# EAGLE design kompass (EAGLE 4.16)
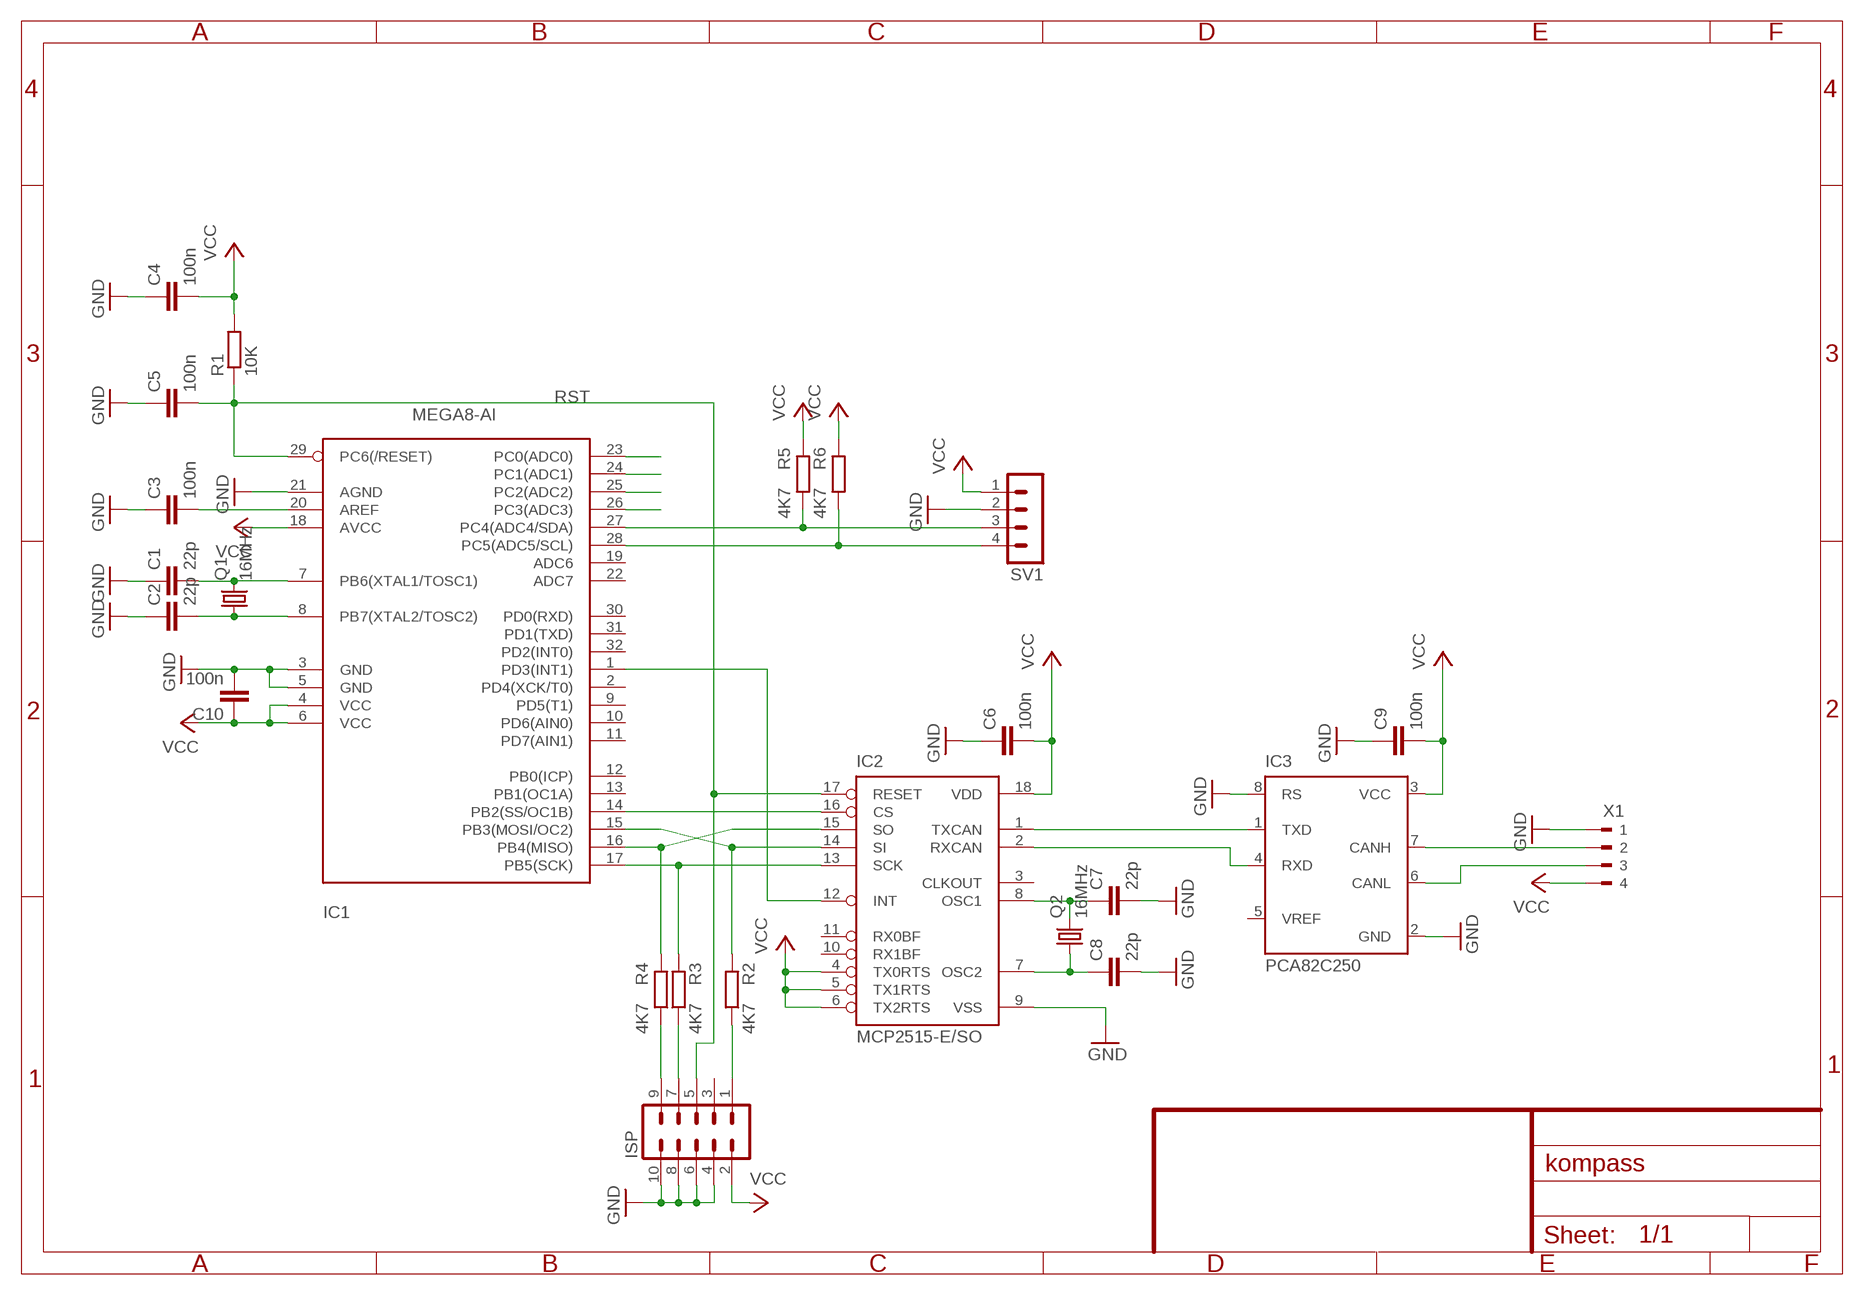
[diagram p0: schematic, sheet 1]

## Parts
C1  22p  C-EUC0603  [C0603]
C2  22p  C-EUC0603  [C0603]
C3  100n  C-EUC0603  [C0603]
C4  100n  C-EUC0603  [C0603]
C5  100n  C-EUC0603  [C0603]
C6  100n  C-EUC0603  [C0603]
C7  22p  C-EUC0603  [C0603]
C8  22p  C-EUC0603  [C0603]
C9  100n  C-EUC0603  [C0603]
C10  100n  C-EUC0603  [C0603]
IC1  MEGA8-AI  [TQFP32-08]
IC2  MCP2515-E/SO  [SO18L]
IC3  PCA82C250  [DIL08]
ISP  MA05-2  [MA05-2]
Q1  16MHz  CRYSTALHC49U-V  [HC49U-V]
Q2  16MHz  CRYSTALHC49U-V  [HC49U-V]
R1  10K  R-EU_R0805  [R0805]
R2  4K7  R-EU_R0805  [R0805]
R3  4K7  R-EU_R0805  [R0805]
R4  4K7  R-EU_R0805  [R0805]
R5  4K7  R-EU_R0805  [R0805]
R6  4K7  R-EU_R0805  [R0805]
SV1  MA04-1  [MA04-1]
X1  90-4  [90-4]

## Nets
GND: C1.1 C2.1 C3.1 C4.1 C5.1 C6.1 C7.2 C8.2 C9.1 C10.2 IC1.3(GND) IC1.5(GND) IC1.21(AGND) IC2.9(VSS) IC3.2(GND) IC3.8(RS) ISP.4 ISP.6 ISP.8 ISP.10 SV1.2 X1.1
N$1: IC3.7(CANH) X1.2
N$2: IC3.6(CANL) X1.3
N$3: C1.2 IC1.7(PB6(XTAL1/TOSC1)) Q1.2
N$4: C2.2 IC1.8(PB7(XTAL2/TOSC2)) Q1.1
N$5: C3.2 IC1.20(AREF)
N$6: IC1.14(PB2(SS/OC1B)) IC2.16(CS)
N$7: IC1.17(PB5(SCK)) IC2.13(SCK) R3.2
N$8: IC1.16(PB4(MISO)) IC2.15(SO) R4.2
N$9: IC1.15(PB3(MOSI/OC2)) IC2.14(SI) R2.2
N$10: IC1.1(PD3(INT1)) IC2.12(INT)
N$11: IC2.1(TXCAN) IC3.1(TXD)
N$12: IC2.2(RXCAN) IC3.4(RXD)
N$13: C7.1 IC2.8(OSC1) Q2.2
N$14: C8.1 IC2.7(OSC2) Q2.1
N$15: ISP.1 R2.1
N$16: ISP.7 R3.1
N$17: ISP.9 R4.1
N$18: IC1.28(PC5(ADC5/SCL)) R6.1 SV1.4
N$19: IC1.27(PC4(ADC4/SDA)) R5.1 SV1.3
N$20: IC1.26(PC3(ADC3))
N$21: IC1.25(PC2(ADC2))
N$22: IC1.24(PC1(ADC1))
N$23: IC1.23(PC0(ADC0))
RST: C5.2 IC1.29(PC6(/RESET)) IC2.17(RESET) ISP.5 R1.1
VCC: C4.2 C6.2 C9.2 C10.1 IC1.4(VCC) IC1.6(VCC) IC1.18(AVCC) IC2.4(TX0RTS) IC2.5(TX1RTS) IC2.6(TX2RTS) IC2.18(VDD) IC3.3(VCC) ISP.2 R1.2 R5.2 R6.2 SV1.1 X1.4
Unconnected: IC1.2(PD4(XCK/T0)) IC1.9(PD5(T1)) IC1.10(PD6(AIN0)) IC1.11(PD7(AIN1)) IC1.12(PB0(ICP)) IC1.13(PB1(OC1A)) IC1.19(ADC6) IC1.22(ADC7) IC1.30(PD0(RXD)) IC1.31(PD1(TXD)) IC1.32(PD2(INT0)) IC2.3(CLKOUT) IC2.10(RX1BF) IC2.11(RX0BF) IC3.5(VREF) ISP.3

## Library data of the parts
C1-C10 = rcl:C-EU: CAPACITOR, European symbol
IC1 = atmel:MEGA8: MICROCONTROLLER 8 Kbytes FLASH 1 kbytes SRAM 512 bytes EEPROM USART 6-channel 10 bit ADC 2-channel 8 bit ADC Source: avr.lbr
IC2 = mcp2515:MCP2515
IC3 = micro-philips:PCA82C250: CAN CONTROLLER INTERFACE
ISP = con-lstb:MA05-2: PIN HEADER
Q1 Q2 = crystal:CRYSTAL: CRYSTAL
R1-R6 = rcl:R-EU_: RESISTOR, European symbol
SV1 = con-lstb:MA04-1: PIN HEADER
X1 = con-weidmueller-sl35:90-4: WEIDMUELLER CLAMP CONNECTOR

## Board
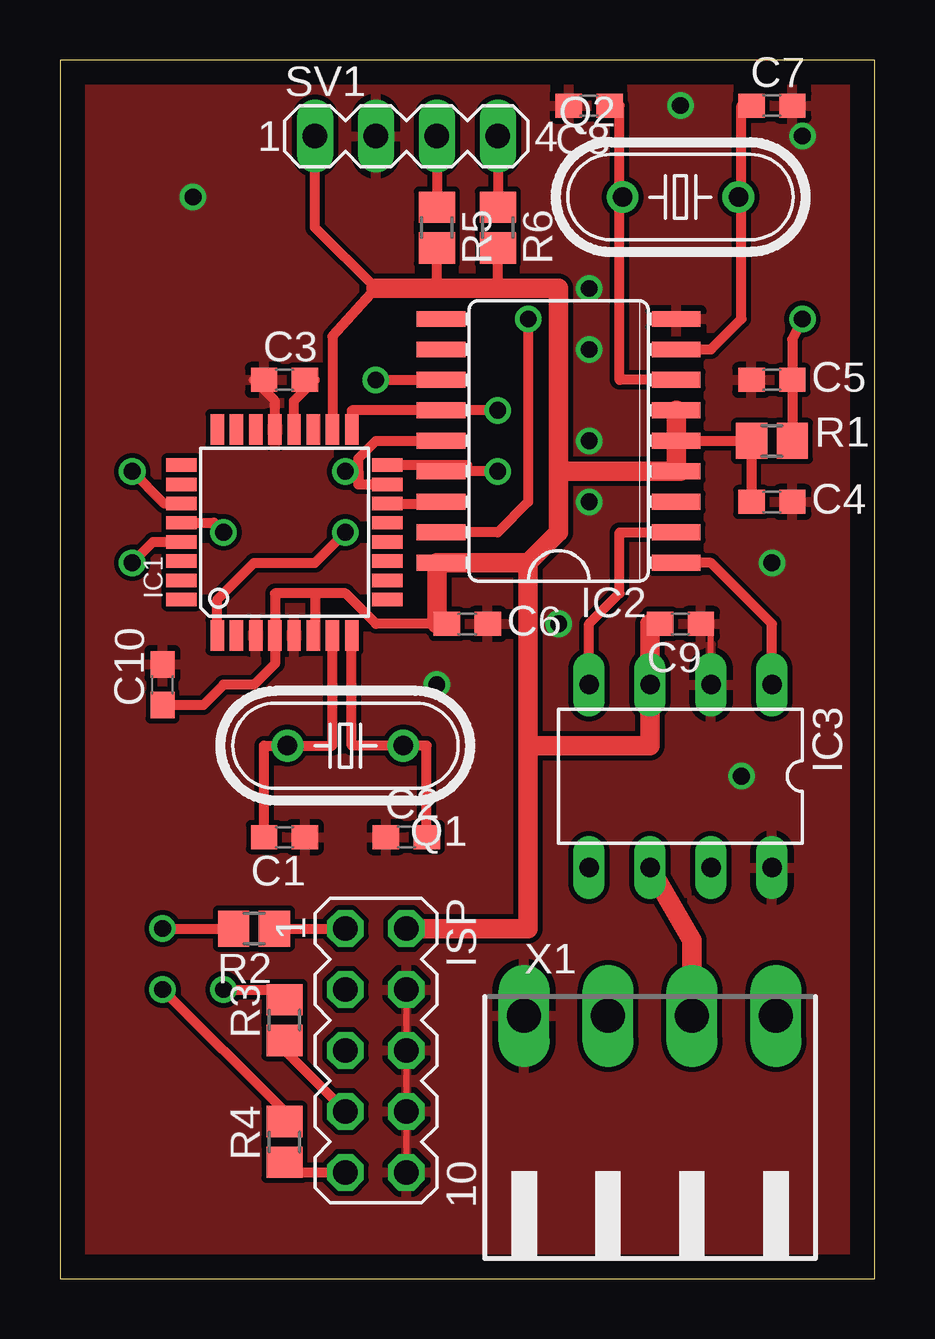
[diagram p1: board, top side]
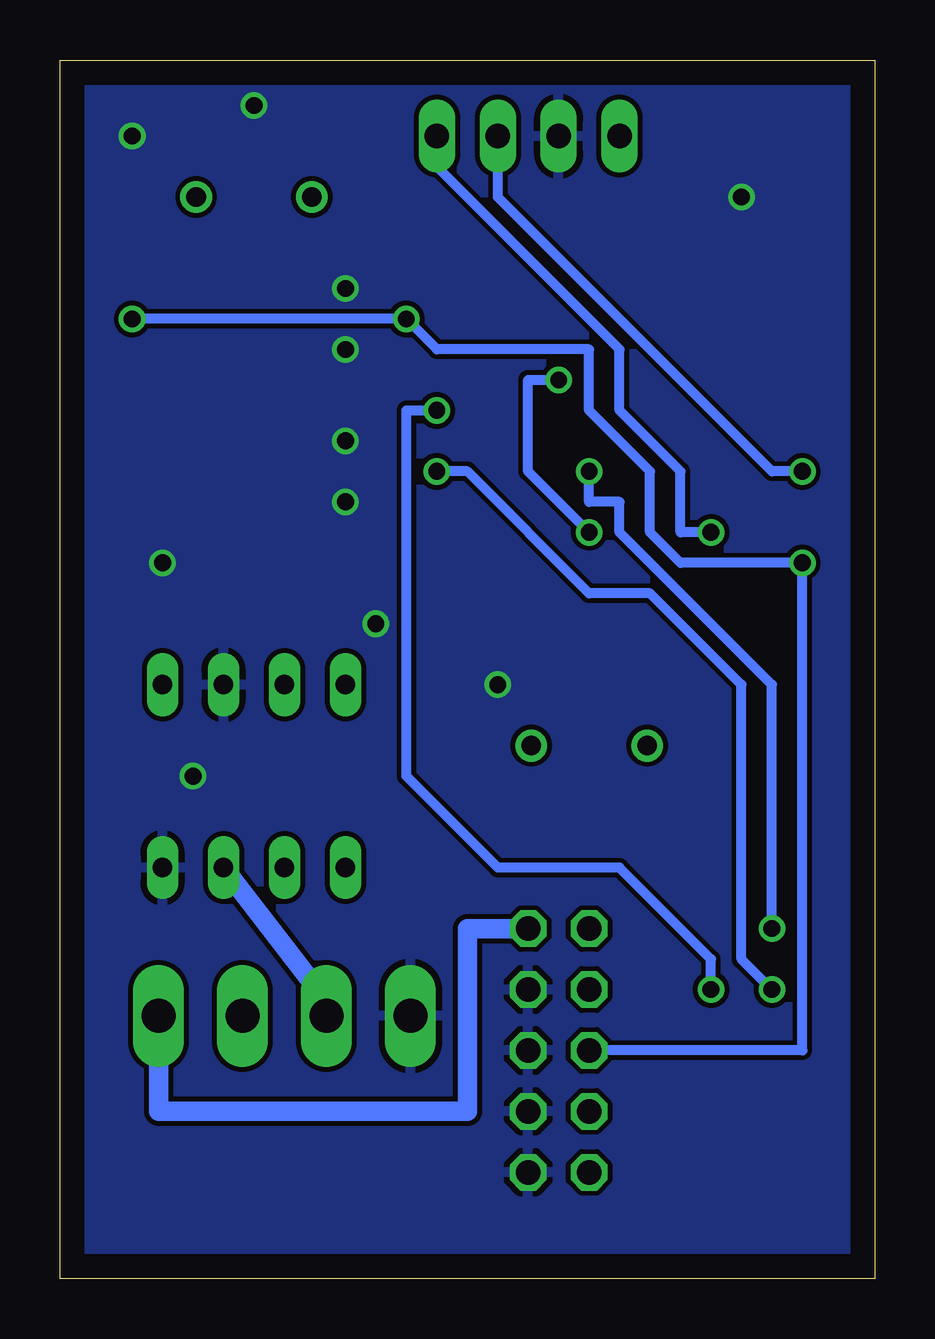
[diagram p2: board, bottom side, seen from below]

Size 33.96 x 50.79 mm. Coordinates in mm from the lower left corner, seen from the top.
Outline: 0,0 33.96,0 33.96,50.79 0,50.79 0,0
Copper layers (1*16): Top 0.035mm / dielectric 1.5mm / Bottom 0.035mm
Design rules "olimex_8mils": minimum track width 10mil, minimum drill 24mil, track to track 8mil, track to pad 8mil, pad to pad 8mil, via to via 8mil, smd to smd 8mil, copper to edge 40mil, drill to drill 10mil, minimum pad ring 10mil, minimum via ring 8mil, stop-mask expansion 0mil, vias tented up to drill 0mil, thermal gap 10mil

### Footprints (pad centres in the part's own frame; a part is rotated, then mirrored left to right if it is on the bottom)
C0603 = smd 1.1 x 1: 1 -0.85,0; 2 0.85,0
TQFP32-08 = smd 1.27 x 0.559: 1 -4.293,2.8; 2 -4.293,2; 3 -4.293,1.2; 4 -4.293,0.4; 5 -4.293,-0.4; 6 -4.293,-1.2; 7 -4.293,-2; 8 -4.293,-2.8; 17 4.293,-2.8; 18 4.293,-2; 19 4.293,-1.2; 20 4.293,-0.4; 21 4.293,0.4; 22 4.293,1.2; 23 4.293,2; 24 4.293,2.8 | smd 0.559 x 1.27: 9 -2.8,-4.293; 10 -2,-4.293; 11 -1.2,-4.293; 12 -0.4,-4.293; 13 0.4,-4.293; 14 1.2,-4.293; 15 2,-4.293; 16 2.8,-4.293; 25 2.8,4.293; 26 2,4.293; 27 1.2,4.293; 28 0.4,4.293; 29 -0.4,4.293; 30 -1.2,4.293; 31 -2,4.293; 32 -2.8,4.293
SO18L = smd 0.66 x 2.032: 1 -5.08,-4.902; 2 -3.81,-4.902; 3 -2.54,-4.902; 4 -1.27,-4.902; 5 0,-4.902; 6 1.27,-4.902; 7 2.54,-4.902; 8 3.81,-4.902; 9 5.08,-4.902; 10 5.08,4.902; 11 3.81,4.902; 12 2.54,4.902; 13 1.27,4.902; 14 0,4.902; 15 -1.27,4.902; 16 -2.54,4.902; 17 -3.81,4.902; 18 -5.08,4.902
DIL08 = drill 0.813 long: 1 -3.81,-3.81; 2 -1.27,-3.81; 3 1.27,-3.81; 4 3.81,-3.81; 5 3.81,3.81; 6 1.27,3.81; 7 -1.27,3.81; 8 -3.81,3.81
MA05-2 = drill 1.016 octagon: 1 -5.08,-1.27; 2 -5.08,1.27; 3 -2.54,-1.27; 4 -2.54,1.27; 5 0,-1.27; 6 0,1.27; 7 2.54,-1.27; 8 2.54,1.27; 9 5.08,-1.27; 10 5.08,1.27
HC49U-V = drill 0.813 round: 1 -2.413,0; 2 2.413,0
R0805 = smd 1.3 x 1.5: 1 -0.85,0; 2 0.85,0
MA04-1 = drill 1.016 long: 1 -3.81,0; 2 -1.27,0; 3 1.27,0; 4 3.81,0
90-4 = drill 1.422 long: 1 -5.25,5.25; 2 -1.75,5.25; 3 1.75,5.25; 4 5.25,5.25

### Placement (x,y rotation side)
C1  9.36,18.41 180 top
C2  14.44,18.41 0 top
C3  9.36,37.46 0 top
C4  29.68,32.38 180 top
C5  29.68,37.46 0 top
C6  16.98,27.3 180 top
C7  29.68,48.89 0 top
C8  22.06,48.89 180 top
C9  25.87,27.3 180 top
C10  4.28,24.76 90 top
IC1  9.36,31.11 90 top
IC2  20.79,34.92 90 top
IC3  25.87,20.95 180 top
ISP  13.17,9.52 270 top
Q1  11.9,22.22 180 top
Q2  25.87,45.08 0 top
R1  29.68,34.92 180 top
R2  8.09,14.6 180 top
R3  9.36,10.79 90 top
R4  9.36,5.71 90 top
R5  15.71,43.81 270 top
R6  18.25,43.81 270 top
SV1  14.44,47.62 0 top
X1  24.6,5.71 0 top

### Tracks (layer width: path | path; a pad name or v marks a point on that pad's centre or on a via)
GND  (via drill 0.7)
  Top 0.254: C4.1 30.95,32.38 | ISP.4 ISP.6 ISP.8 ISP.10 | C9.1 27.14,27.3 IC3.2
  Top 0.406: C3.1 8.09,37.46 8.96,36.59 IC1.21
  other vias: 25.87,48.89 28.41,20.95 29.68,29.84 30.95,47.62 22.06,32.38 22.06,34.92 22.06,38.73 22.06,41.27 20.79,27.3 5.55,45.08 15.71,24.76
  pour Bottom: 33.49,50.16 0.47,50.16 0.47,0.63 33.49,0.63
  pour Top: 33.49,50.16 0.47,50.16 0.47,0.63 33.49,0.63
N$1
  Bottom 0.813: X1.2 22.85,11.58 IC3.7
N$2
  Top 0.813: X1.3 26.35,14.12 IC3.6
N$3
  Top 0.406: IC1.7 11.36,22.22 Q1.2 8.51,22.22 C1.2
N$4
  Top 0.406: Q1.1 13.17,22.22 | IC1.8 12.16,22.22 Q1.1 | C2.2 15.29,22.22 Q1.1
N$5
  Top 0.406: C3.2 10.63,37.46 9.76,36.59 IC1.20
N$6
  Top 0.406: IC2.16 15.71,32.38 15.71,32.31 IC1.14
N$7  (via drill 0.7)
  Top 0.406: IC1.17 12.16,36.19 15.71,36.19 | 15.71,36.19 IC2.13 | v18.25,36.19 15.71,36.19 | R3.2 9.36,12.06 v6.82,12.06
  Bottom 0.406: v18.25,36.19 19.52,36.19 19.52,20.95 15.71,17.14 10.63,17.14 6.82,13.33 v6.82,12.06
N$8  (via drill 0.7)
  Top 0.406: IC1.16 16.98,33.91 16.98,33.65 IC2.15 | IC2.15 15.71,33.65 | v18.25,33.65 IC2.15 | R4.2 9.36,6.98 v4.28,12.06
  Bottom 0.406: v18.25,33.65 16.98,33.65 11.9,28.57 9.36,28.57 5.55,24.76 5.55,13.33 v4.28,12.06
N$9  (via drill 0.7)
  Top 0.406: IC2.14 13.17,34.92 12.44,34.19 12.44,33.11 | 12.44,33.11 IC1.15 | 12.44,33.11 12.44,33.65 v11.9,33.65 | v4.28,14.6 R2.2
  Bottom 0.406: v11.9,33.65 11.9,32.38 10.63,32.38 10.63,31.11 4.28,24.76 v4.28,14.6
N$10  (via drill 0.7)
  Top 0.406: v13.17,37.46 IC2.12 | IC1.1 6.56,28.31 8.09,29.84 10.63,29.84 v11.9,31.11
  Bottom 0.406: v13.17,37.46 14.44,37.46 14.44,33.65 v11.9,31.11
N$11
  Top 0.406: IC2.1 27.14,29.84 29.68,27.3 IC3.1
N$12
  Top 0.406: IC2.2 23.33,31.11 23.33,28.57 22.06,27.3 IC3.4
N$13
  Top 0.406: 28.41,45.08 28.41,40 27.14,38.73 IC2.8 | C7.1 28.41,48.89 28.41,45.08 | 28.41,45.08 Q2.2
N$14
  Top 0.406: IC2.7 23.33,37.46 23.33,45.08 | C8.1 23.33,48.89 23.33,45.08 | 23.33,45.08 Q2.1
N$15
  Top 0.406: R2.1 ISP.1
N$16
  Top 0.406: R3.1 9.36,9.52 ISP.7
N$17
  Top 0.406: R4.1 9.36,4.44 ISP.9
N$18  (via drill 0.7)
  Top 0.406: SV1.4 R6.1 | IC1.28 6.42,31.51 v6.82,31.11
  Bottom 0.406: SV1.4 18.25,46.35 10.63,38.73 10.63,36.19 8.09,33.65 8.09,31.11 v6.82,31.11
N$19  (via drill 0.7)
  Top 0.406: SV1.3 R5.1 | IC1.27 4.35,32.31 v3.01,33.65
  Bottom 0.406: v3.01,33.65 4.28,33.65 15.71,45.08 SV1.3
RST  (via drill 0.7)
  Top 0.406: IC2.17 18.25,31.11 19.52,32.38 v19.52,40 | 30.95,35.34 R1.1 C5.2 30.53,39.15 v30.95,40 | IC1.29 3.88,30.71 v3.01,29.84
  Bottom 0.406: v30.95,40 v19.52,40 18.25,38.73 11.9,38.73 11.9,36.19 9.36,33.65 9.36,31.11 8.09,29.84 v3.01,29.84 3.01,9.52 ISP.5
VCC
  Top 0.406: C4.2 R1.2 25.87,34.92 | IC1.6 10.63,26.82 10.63,28.57 | 10.63,28.57 8.96,28.57 IC1.4 8.96,25.63 8.09,24.76 6.82,24.76 5.97,23.91 C10.1 | IC1.18 11.36,39.27 13.17,41.27 10.63,43.81 SV1.1 | 10.63,28.57 11.9,28.57 13.17,27.3 15.71,27.3 | 15.71,41.27 R5.2 | 18.25,41.27 R6.2
  Top 0.813: IC2.6 25.69,35.1 25.87,34.92 IC2.5 25.69,33.83 25.87,33.65 IC2.4 20.79,33.65 | 20.79,33.65 20.79,31.11 19.52,29.84 | 19.52,29.84 IC2.18 15.71,29.84 15.71,27.3 C6.2 | C9.2 24.6,27.3 IC3.3 24.6,22.22 19.52,22.22 | 20.79,33.65 20.79,41.27 18.25,41.27 15.71,41.27 13.17,41.27 | 19.52,22.22 19.52,29.84 | 19.52,22.22 19.52,14.6 ISP.2
  Bottom 0.813: X1.4 29.85,6.98 16.98,6.98 16.98,14.6 ISP.2